# Altium schematic sheet FT2232HQ_LATTICE_JTAG.SchDoc: <title>
size C; Organization: Custom Embedded Solutions, LLC.; Address1: 130 Oakland Trace; Address2: Madison, AL 35758; DocumentNumber: <doc_num>; Revision: <Rev>; SheetNumber: 6; SheetTotal: 8; PageTitle: USB JTAG Interface
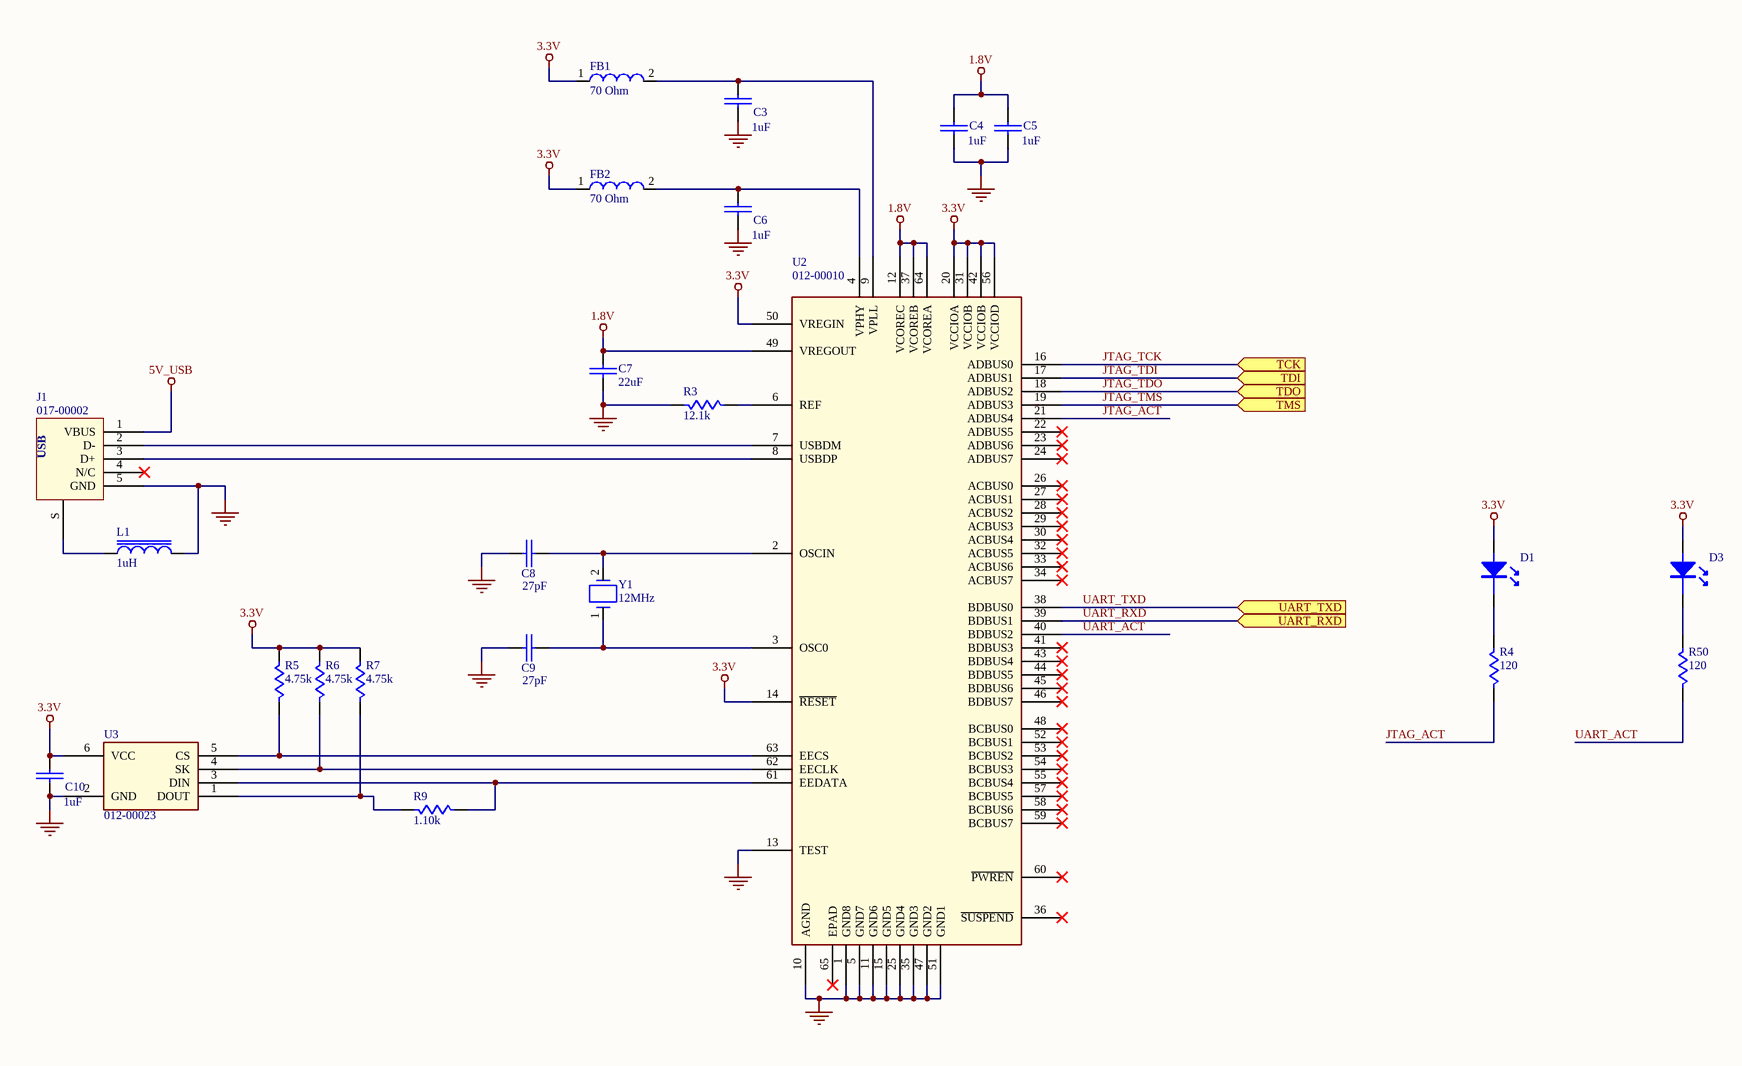
[diagram p0: FT2232HQ_LATTICE_JTAG.SchDoc]

## Parts
C3  1uF  [005-00008]
C4  1uF  [005-00008]
C5  1uF  [005-00008]
C6  1uF  [005-00008]
C7  22uF  [005-00003]
C8  27pF  [005-00008]
C9  27pF  [005-00008]
C10  1uF  [005-00008]
D1  (no value)  [005-00018]
D3  (no value)  [005-00018]
FB1  70 Ohm  [005-00010]
FB2  70 Ohm  [005-00010]
J1  Part Number: 017-00002  [005-00007]  (hidden comment: USB - Micro B)
L1  1uH  [005-00001]
R3  12.1k  [005-00009]
R4  120  [005-00009]
R5  4.75k  [005-00009]
R6  4.75k  [005-00009]
R7  4.75k  [005-00009]
R9  1.10k  [005-00009]
R50  120  [005-00009]
U2  Part Number: 012-00010  [005-00004]
U3  Part Number: 012-00023  [005-00006]  (hidden comment: 93LC56)
Y1  12MHz  [005-00005]

## Ports
TCK (in), TDI (in), TDO (in), TMS (in), UART_RXD (in), UART_TXD (in)

## Nets
1.8V: C4.1 C5.1 C7.1 U2.12(VCOREC) U2.37(VCOREB) U2.49(VREGOUT) U2.64(VCOREA)
3.3V: C10.1 D1.ANODE D3.ANODE FB1.1 FB2.1 R5.1 R6.1 R7.1 U2.14(~{RESET}) U2.20(VCCIOA) U2.31(VCCIOB) U2.42(VCCIOB) U2.50(VREGIN) U2.56(VCCIOD) U3.6(VCC)
5V_USB: J1.1(VBUS)
GND: C3.2 C4.2 C5.2 C6.2 C7.2 C8.1 C9.1 C10.2 J1.5(GND) L1.2 R3.1 U2.1(GND8) U2.5(GND7) U2.10(AGND) U2.11(GND6) U2.13(TEST) U2.15(GND5) U2.25(GND4) U2.35(GND3) U2.47(GND2) U2.51(GND1) U3.2(GND)
JTAG_ACT: R4.2 U2.21(ADBUS4)
JTAG_TCK: U2.16(ADBUS0) ; port TCK
JTAG_TDI: U2.17(ADBUS1) ; port TDI
JTAG_TDO: U2.18(ADBUS2) ; port TDO
JTAG_TMS: U2.19(ADBUS3) ; port TMS
UART_ACT: R50.2 U2.40(BDBUS2)
UART_RXD: U2.39(BDBUS1) ; port UART_RXD
UART_TXD: U2.38(BDBUS0) ; port UART_TXD
NetC3_1: C3.1 FB1.2 U2.9(VPLL)
NetC6_1: C6.1 FB2.2 U2.4(VPHY)
NetC8_2: C8.2 U2.2(OSCIN) Y1.2
NetC9_2: C9.2 U2.3(OSC0) Y1.1
NetD1_CATHODE: D1.CATHODE R4.1
NetD3_CATHODE: D3.CATHODE R50.1
NetJ1_2: J1.2(D-) U2.7(USBDM)
NetJ1_3: J1.3(D+) U2.8(USBDP)
NetJ1_S: J1.S L1.1
NetR3_2: R3.2 U2.6(REF)
NetR5_2: R5.2 U2.63(EECS) U3.5(CS)
NetR6_2: R6.2 U2.62(EECLK) U3.4(SK)
NetR7_2: R7.2 R9.1 U3.1(DOUT)
NetR9_2: R9.2 U2.61(EEDATA) U3.3(DIN)

Not connected (* = marked no-connect by the designer): J1 4(N/C)*; U2 22(ADBUS5)* 23(ADBUS6)* 24(ADBUS7)* 26(ACBUS0)* 27(ACBUS1)* 28(ACBUS2)* 29(ACBUS3)* 30(ACBUS4)* 32(ACBUS5)* 33(ACBUS6)* 34(ACBUS7)* 36(~{SUSPEND})* 41(BDBUS3)* 43(BDBUS4)* 44(BDBUS5)* 45(BDBUS6)* 46(BDBUS7)* 48(BCBUS0)* 52(BCBUS1)* 53(BCBUS2)* 54(BCBUS3)* 55(BCBUS4)* 57(BCBUS5)* 58(BCBUS6)* 59(BCBUS7)* 60(~{PWREN})* 65(EPAD)*

## Notes on the sheet
- Copyright (c)
- Page Title
- Design Title
- Creative Commons License, http://creativecommons.org/licenses/by/4.0/legalcode
  This PCB design by Custom Embedded Solutions, LLC. is licensed under a Creative Commons Attribution 4.0 International License.
- Size:
- Date:
- File:
- C
- Document Number:
- Time:
- Sheet
- Rev:
- of
- (in symbol 017-00002) USB

## Library data of the parts
C3-C6 C10 = 011-00010: Capacitor 1uF 10V Ceramic 10% 0402; 3rd Party: {Reference Design}; Manufacturer1: AVX; Manufacturer1 Part Number: 0402ZD105KAT2A; Types: Ratings; Part Number: 011-00010; Type: Ceramic; Value: 1uF; Voltage: 10V; Package: 1005, EIA 0402, Chip Capacitor, 2-Leads, Body 1.00x0.50mm, IPC High Density
C7 = 011-00004: CAP CER 22UF 6.3V X5R 20% 0805; Manufacturer1: TDK; Manufacturer1 Part Number: C2012X5R0J226M/1.25; 3rd Party: {Reference Design}; Manufacturer2 Part Number: CL21A226KQQNNNF; Manufacturer3 Part Number: 08056D226MAT2A; Type: Ceramic; Part Number: 011-00004; Value: 22uF; Voltage: 6.3V; Substrate: X5R; Package: 2012, EIA 0805, Chip Capacitor, 2-Leads, Body 2.00x1.25mm, IPC High Density; Manufacturer2: Samsung; Manufacturer3: AVX
C8 C9 = 011-00016: CAP CER 27PF 50V 5% C0G 0402; 3rd Party: {Reference Design}; Manufacturer1: Murata; Manufacturer1 Part Number: GRM1555C1H270JZ01D; Types: X2Y3; Type: Ceramic; Part Number: 011-00016; Value: 27pF; Voltage: 50V; Substrate: C0G; Package: 1005, EIA 0402, Chip Capacitor, 2-Leads, Body 1.00x0.50mm, IPC High Density
D1 D3 = 013-00003: LED Green SMD 20mA 2.2V 0603; Manufacturer1: Osram; Manufacturer1 Part Number: LG Q971-KN-1; Types: PNP; Preferred: Yes; Part Number: 013-00003; Type: LED; Current: 20mA; Voltage: 2.2V; Package: 0603, LED
FB1 FB2 = 010-00004: FERRITE CHIP 70 OHM 4000MA 0603; Manufacturer1: Samsung; Manufacturer1 Part Number: CIS10P700AC; Types: Signal Transformer; Current: 4A; DCR: 20mOhm; Preferred: Yes; Part Number: 010-00004; Type: Ferrite; Value: 70 Ohm; Package: 1608, EIA 0603, Chip Inductor, 2-Leads, Body 1.60x0.80mm, IPC High Density
J1 = 017-00002: CONN RECEPT USB 5POS RT ANG SMD; Manufacturer1: FCI; Manufacturer1 Part Number: 10118192-0001LF; Types: USB micro; Circuits: 5; Validation: Built; Preferred: Yes; Type: USB micro; Value: USB - Micro B; Package: Connector, USB, Micro B, Samtec
L1 = 010-00003: INDUCTOR POWER 1UH 2.2A 1008; Manufacturer1: Samsung; Manufacturer1 Part Number: CIG22E1R0MNE; Types: Signal Inductor; Type: Power Inductor; Tolerance: 0.2; Saturation Current: 2.3A; DCR: 48mOhm; Shielded: Yes; Validation: None; Part Number: 010-00003; Value: 1uH; Current: 2.2A; Package: 2520, EIA 1008, Chip Inductor, 2-Leads, Body 2.50x2.00mm, IPC High Density
R3 = 009-00002: RES 12.1K OHM 1/16W 1% 0402 SMD; 3rd Party: {Reference Design}; Manufacturer1: Yageo; Manufacturer1 Part Number: RC0402FR-0712K1L; Types: Thick Film; Tolerance: 0.01; Part Number: 009-00002; Value: 12.1k; Power: 1/16W; Package: 1005, EIA 0402, Chip Resistor, 2-Leads, Body 1.00x0.50mm, IPC High Density
R4 R50 = 009-00021: RES 120 OHM 1/16W 5% 0402; Manufacturer1: Stackpole Electronics; Manufacturer1 Part Number: RMCF0402JT120R; Tolerance: 0.05; Part Number: 009-00021; Value: 120; Power: 1/16W; Package: 1005, EIA 0402, Chip Resistor, 2-Leads, Body 1.00x0.50mm, IPC High Density
R5-R7 = 009-00001: RES 4.75K OHM 1/16W 1% 0402 SMD; 3rd Party: {Reference Design}; Manufacturer1: Stackpole Electronics; Manufacturer1 Part Number: RMCF0402FT4K75; Types: Metal Film; Tolerance: 0.01; Part Number: 009-00001; Value: 4.75k; Power: 1/16W; Package: 1005, EIA 0402, Chip Resistor, 2-Leads, Body 1.00x0.50mm, IPC High Density
R9 = 009-00008: RES 1.10K OHM 1/16W 1% 0402 SMD; 3rd Party: {Reference Design}; Manufacturer1: Yageo; Manufacturer1 Part Number: RC0402FR-071K1L; Tolerance: 0.01; Part Number: 009-00008; Value: 1.10k; Power: 1/16W; Package: 1005, EIA 0402, Chip Resistor, 2-Leads, Body 1.00x0.50mm, IPC High Density
U2 = 012-00010: IC USB HS DUAL UART/FIFO 64-QFN; Manufacturer1: FTDI; Manufacturer1 Part Number: FT2232HQ; Type: Interface; Package: QFN, 64-Leads, Body 9.00x9.00mm, Pitch 0.50mm, Thermal Pad 4.35x4.35mm, IPC High Density
U3 = 012-00023: IC EEPROM 2KBIT 2MHZ SOT23-6; Manufacturer1: Microchip Technology; Manufacturer1 Part Number: 93LC56BT-I/OT; Type: Memory; Value: 93LC56; Package: SOT23, 6-Leads, Body 2.90x2.70mm, Pitch 0.95mm, IPC High Density
Y1 = 015-00006: CRYSTAL 12.000 MHZ 10PF SMD; Manufacturer1: TXC CORPORATION; Manufacturer1 Part Number: 7A-12.000MAAJ-T; Capacitance: 18pF; Stability: 30ppm; Preferred: Yes; Part Number: 015-00006; Value: 12MHz; Tolerance: 30ppm; Package: SMT, XTAL, 2-PAD 3.2mmx2.5mm